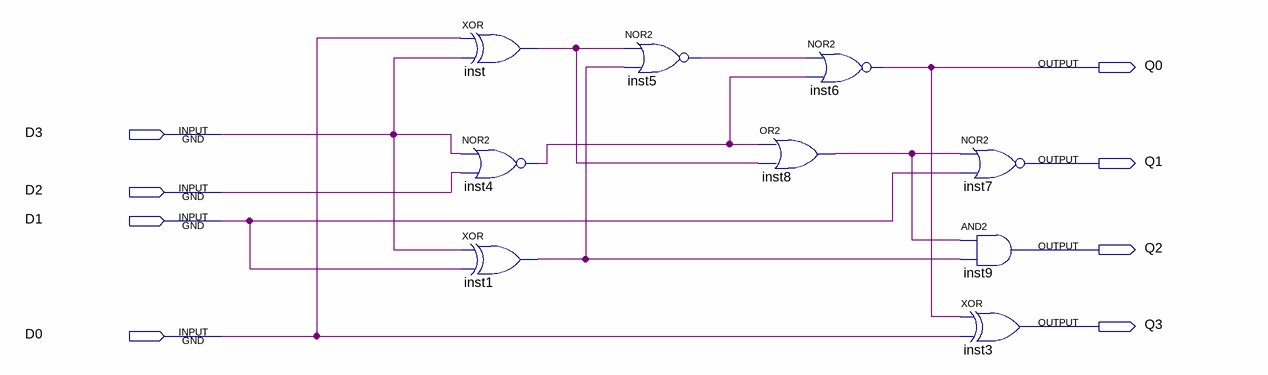
[diagram p0: schematic sheet]
// Quartus schematic Dabble.bdf as structural Verilog: 9 symbols, 8 pins
module Dabble (
  input  D3,
  input  D2,
  input  D1,
  input  D0,
  output Q0,
  output Q1,
  output Q2,
  output Q3
);

  wire inst1_out, inst4_out, inst5_out, inst8_out, inst_out;

  xor inst (inst_out, D0, D3);
  nor inst4 (inst4_out, D3, D2);
  xor inst1 (inst1_out, D3, D1);
  nor inst5 (inst5_out, inst_out, inst1_out);
  or inst8 (inst8_out, inst4_out, inst_out);
  nor inst6 (Q0, inst5_out, inst4_out);
  nor inst7 (Q1, inst8_out, D1);
  and inst9 (Q2, inst8_out, inst1_out);
  xor inst3 (Q3, Q0, D0);
endmodule
